# Altium schematic sheet ESP32-POWER.SchDoc
size B
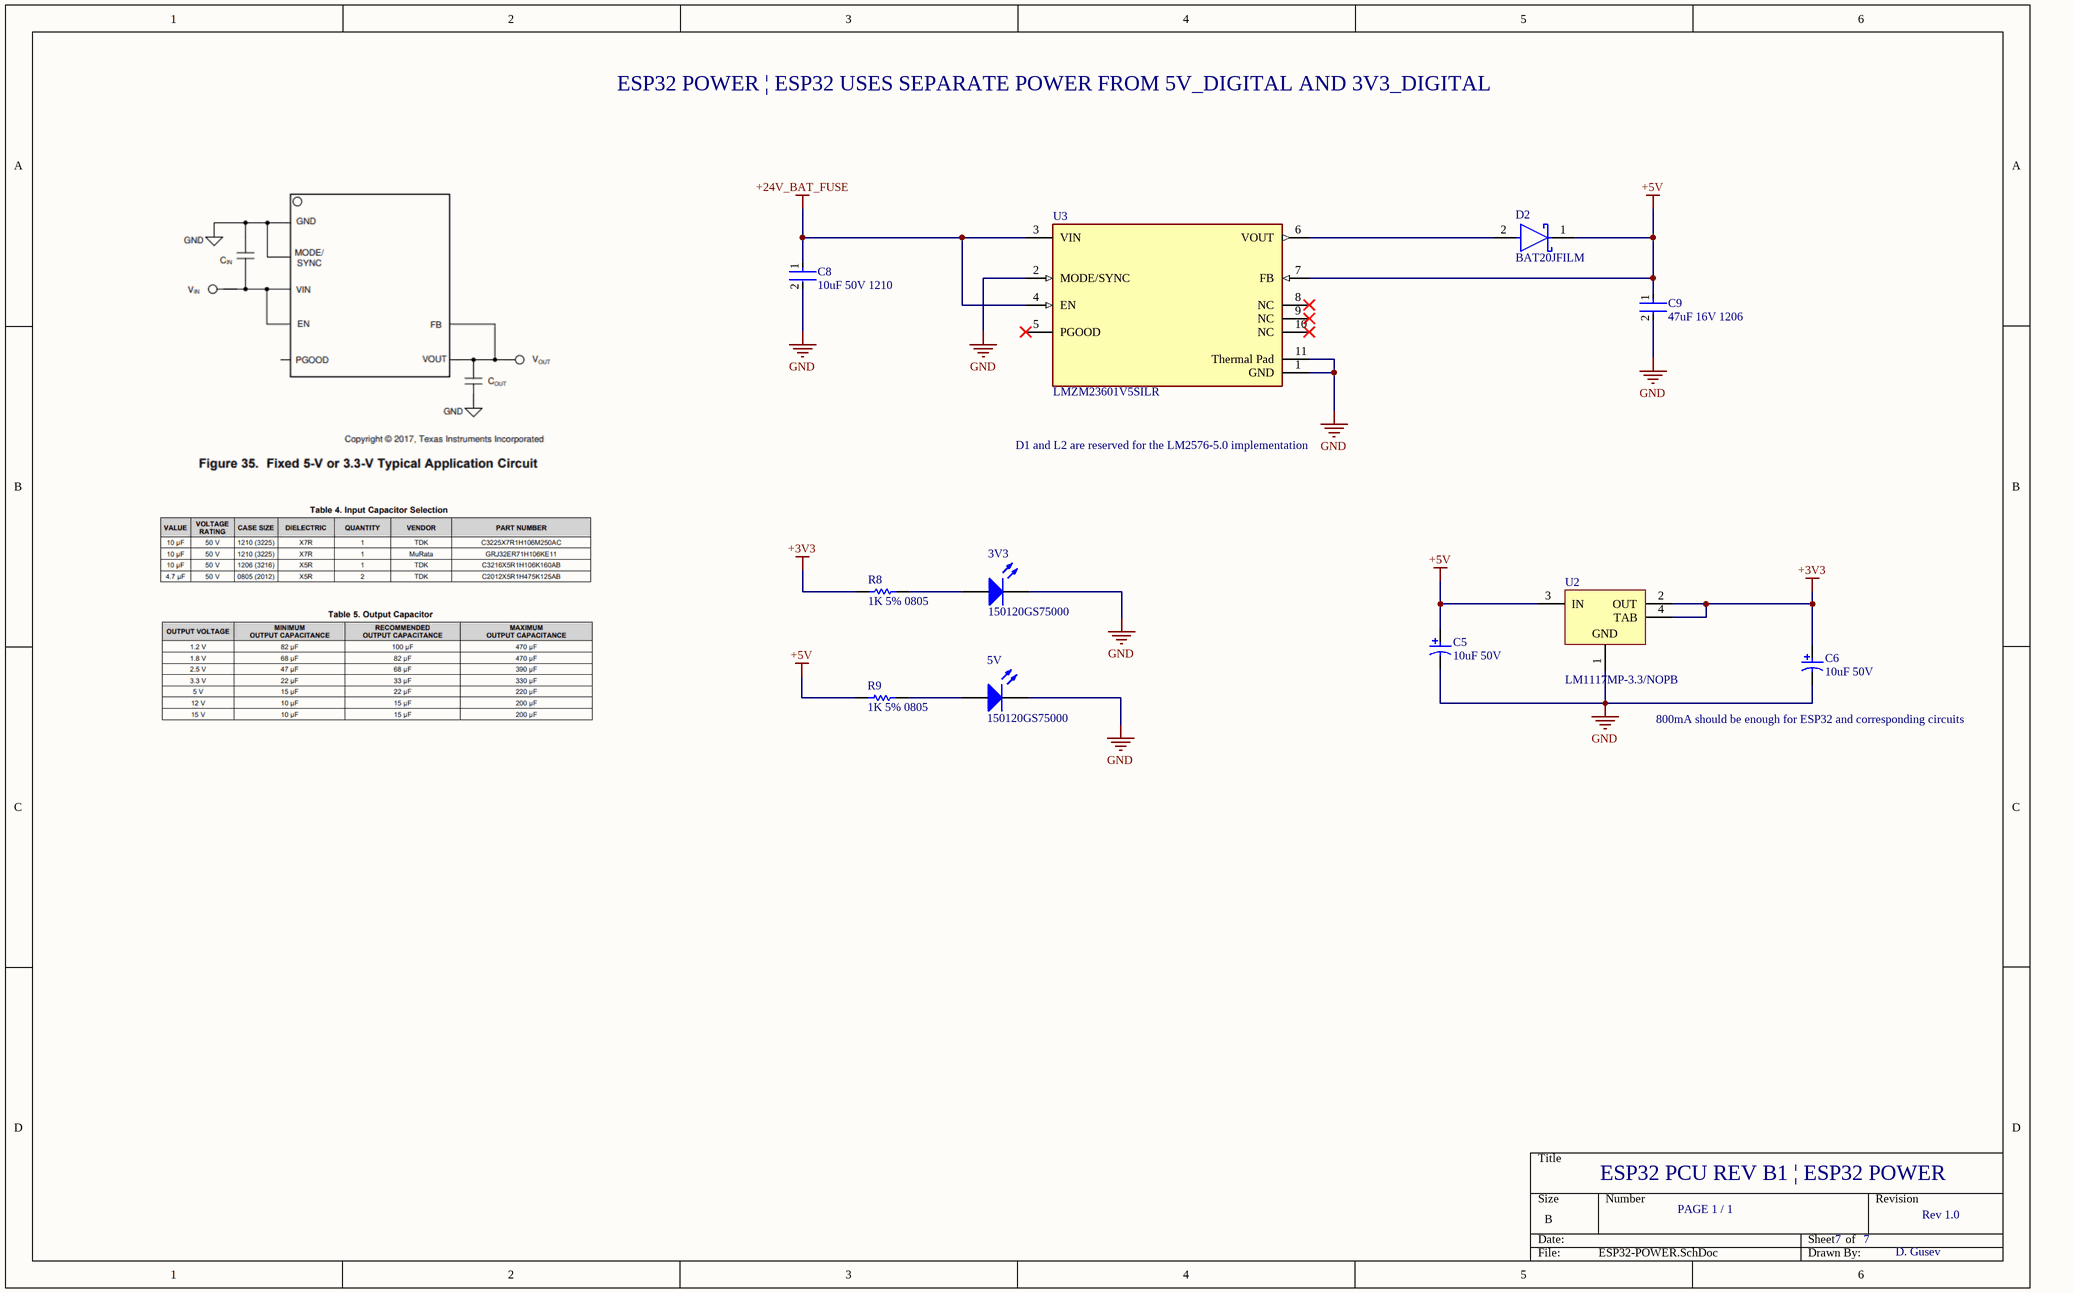
[diagram p0: ESP32-POWER.SchDoc]

## Parts
3V3  150120GS75000  [1206_A]
5V  150120GS75000  [1206_A]
C5  10uF 50V  [PNSC-FK-V-D_V]
C6  10uF 50V  [PNSC-FK-V-D_V]
C8  10uF 50V 1210  [FP-C3225-250-0_4-MFG]
C9  47uF 16V 1206  [FP-C3216-160-0_2-MFG]
D2  BAT20JFILM  [FP-BAT20JFILM-MFG]
R8  1K 5% 0805  [RESC2013X60X40ML20T25]
R9  1K 5% 0805  [RESC2013X60X40ML20T25]
U2  LM1117MP-3.3/NOPB  [DCY0004A_L]
U3  LMZM23601V5SILR  [LMZM23601V5SILR]

## Nets
+3V3: C6.1 R8.2 U2.2(OUT) U2.4(TAB)
+5V: C5.1 C9.1 D2.1(K) R9.2 U2.3(IN) U3.7(FB)
+24V_BAT_FUSE: C8.1 U3.3(VIN) U3.4(EN)
GND: 3V3.1(K) 5V.1(K) C5.2 C6.2 C8.2 C9.2 U2.1(GND) U3.1(GND) U3.2(MODE/SYNC) U3.11(Thermal_Pad)
Net3V3_2: 3V3.2(A) R8.1
Net5V_2: 5V.2(A) R9.1
NetD2_2: D2.2(A) U3.6(VOUT)

Not connected (* = marked no-connect by the designer): U3 5(PGOOD)* 8(NC)* 9(NC)* 10(NC)*

## Notes on the sheet
- ESP32 POWER | ESP32 USES SEPARATE POWER FROM 5V_DIGITAL AND 3V3_DIGITAL
- D1 and L2 are reserved for the LM2576-5.0 implementation
- (near C6) 800mA should be enough for ESP32 and corresponding circuits
- ESP32 PCU REV B1 | ESP32 POWER
- PAGE 1 / 1
- 7
- Rev 1.0
- D. Gusev

## Library data of the parts
3V3 5V = CMP-1426-00014-1: SMD mono-color Chip LED, WL-SMCW, Green; Manufacturer: Wuerth Elektronik; PackageReference: 1206_A; PartNumber: 150120GS75000; ComponentLink1Description: Manufacturer URL; ComponentLink2URL: http://katalog.we-online.com/led/datasheet/150120GS75000.pdf; ComponentLink2Description: Datasheet; Color: Green; ComponentLink1URL: http://www.we-online.com
C5 C6 = CMP-2000-06207-1: Aluminum Electrolytic Capacitor, 10 uF, +/- 20%, 50 V, 2-Pin SMD (Size Code D), -55 to 105 degC, RoHS, Tape and Reel; Manufacturer: Panasonic; Lifetime@Temperature: 2000Hrs@105°C; Type: Can; Ripple Current: 165mA; Impedance: 0.88O; Capacitance: 10µF; Manufacturer URL: http://www.panasonic.com/; Mounting Technology: SurfaceMount; Rated Voltage: 50V; Datasheet URL: http://industrial.panasonic.com/cdbs/www-data/pdf/RDE0000/ABA0000C1181.pdf; Package Reference: FK-V-D; Series: FK; Operating Temp Range: -55to+105°C; Operating Temp-Max: 105°C; Datasheet Version: 03/2016; Package URL: http://industrial.panasonic.com/cdbs/www-data/pdf/RDE0000/DME0000COL48.pdf; Case Size/Dimension: Ø6.3x5.8mm; Package Description: 2-Pin Electrolytic Aluminum Capacitor, Body 6.6 x 6.6 mm
C8 = CMP-08246-002653-1: Multilayer Ceramic Capacitors 10uF ±20% 50V X7R SMD 1210; Width: 0.098inch; Package Quantity: 1000; Height: 2.5mm; Dielectric Material: Ceramic; Voltage Rating: 50V; Series: C; Capacitance: 10uF; Tolerance: 20%; Weight: 0.000564oz; Case/Package: 1210; Case Code (Imperial): 1210; Dielectric: X7R; Case Code (Metric): 3225; REACH SVHC: No SVHC; Packaging: Tape and Reel; Length: 0.126inch; Termination: SMD/SMT; Min Operating Temperature: -55°C; Voltage Rating (DC): 50V; Lead Free: Lead Free; Max Operating Temperature: 125°C; Thickness: 0.11inch; Mount: Surface Mount
C9 = CMP-2000-07442-2: Multilayer Ceramic Capacitors 47uF ±20% 16V X5R SMD 1206; Resistor Type: Ceramic; Width: 0.063inch; Case Code (Imperial): 1206; Radiation Hardening: No; Thickness: 0.071inch; Dielectric: X5R; Weight: 0.000571oz; Termination: SMD/SMT; Dielectric Material: Ceramic; Min Operating Temperature: -55°C; Depth: 1.6mm; Case Code (Metric): 3216; Max Operating Temperature: 85°C; RoHS Compliant: Yes; REACH SVHC: No SVHC; Mount: Surface Mount; Lead Free: Lead Free; Height: 1.6mm; Length: 3.2mm; Tolerance: 20%; Voltage Rating (DC): 16V; Capacitance: 47uF; Package Quantity: 1; Construction: Flat; Packaging: Tape and Reel; Series: C; Case/Package: 1206; Voltage Rating: 16V
D2 = CMP-12187-000030-1: DIODE SCHOTTKY 23V 1A SOD323; Polarity: Standard; Element Configuration: Single; Capacitance: 30pF; Forward Voltage: 620mV; Max Surge Current: 5A; Peak Reverse Current: 12uA; Packaging: Tape and Reel; Weight: 0.01lb; Output Current: 1A; Lead Free: Lead Free; Forward Current: 1A; Mount: Surface Mount; Max Reverse Voltage (DC): 23V; Average Rectified Current: 1A; Max Operating Temperature: 150°C; Max Forward Surge Current (Ifsm): 5A; REACH SVHC: No SVHC; Current Rating: 1A; Length: 1.8mm; Radiation Hardening: No; Max Reverse Leakage Current: 12uA; Voltage Rating (DC): 23V; Height: 1.03mm; Peak Non-Repetitive Surge Current: 5A; Max Repetitive Reverse Voltage (Vrrm): 23V; Min Operating Temperature: -65°C; Number of Pins: 2; Width: 1.35mm; Package Quantity: 1
R8 R9 = CMP-2001-00590-1: Part Number: ERA6AEB123V; Manufacturer: Panasonic
U2 = CMP-0062-01638-4: 800mA Low-Dropout Linear Regulator, 4-pin SOT-223, Pb-Free; Manufacturer: Texas Instruments; CompType: LDO IC; PackageTopMarking: XYTT*N05A; High-Reliability: Y; PowerWise: N; ComponentLink1URL: http://www.ti.com/general/docs/lit/getliterature.tsp?genericPartNumber=LM1117-N&fileType=pdf; PinCount: 4; PackageDescription: Molded SOT-223, 6.50 x 3.56 x 1.6mm Body, 4 Lead, 2.3mm Pitch; Code_IPC: SOT223-4; PartNumber: LM1117MP-3.3/NOPB; Code_JEDEC: TO-261-AA; RoHS: Y; PackageReference: DCY0004A; ComponentLink1Description: Datasheet URL
U3 = LMZM23601V5SILR: DC DC CONVERTER 5V; Max Input Voltage: 36V; Efficiency: 87%; Min Input Voltage: 4V; Number of Outputs: 1; Max Output Current: 1A; Packaging: Cut Tape; Max Operating Temperature: 125°C; RoHS Compliant: Yes; Features: UVLO; Voltage - Output 1: 5V; Min Operating Temperature: -40°C; Mount: Surface Mount